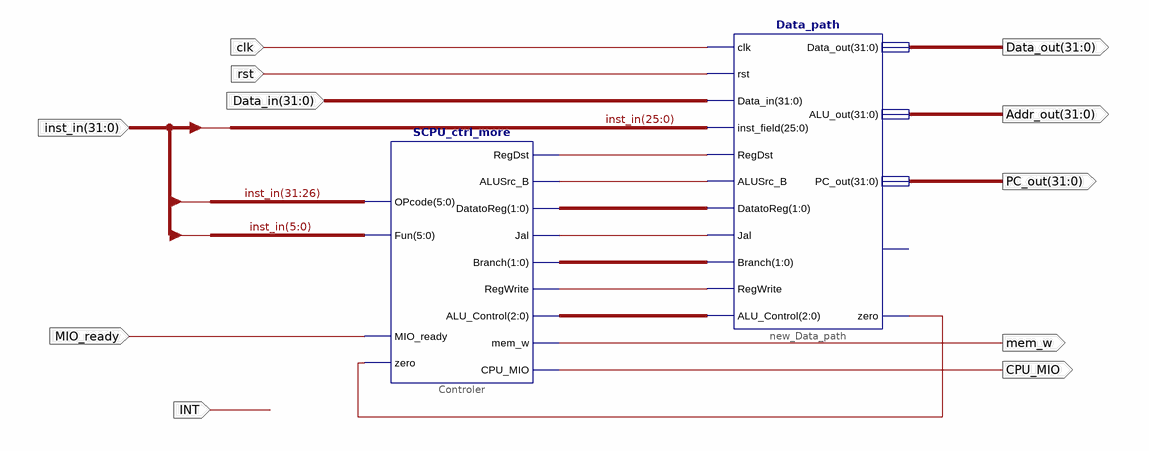
[diagram p0: schematic sheet 1]
// Xilinx ISE schematic SCPU.sch (kintex7) as structural Verilog: 2 symbols, 11 ports
module SCPU (
  input  clk,
  input  rst,
  input  [31:0] Data_in,
  input  [31:0] inst_in,
  input  MIO_ready,
  input  INT,
  output [31:0] Data_out,
  output [31:0] Addr_out,
  output [31:0] PC_out,
  output mem_w,
  output CPU_MIO
);

  wire XLXN_65, XLXN_66, XLXN_68, XLXN_70, XLXN_91;
  wire [1:0] XLXN_67, XLXN_69;
  wire [2:0] XLXN_71;

  SCPU_ctrl_more Controler (
    .RegDst(XLXN_65), .ALUSrc_B(XLXN_66), .DatatoReg(XLXN_67), .Jal(XLXN_68), .mem_w(mem_w),
    .Branch(XLXN_69), .RegWrite(XLXN_70), .ALU_Control(XLXN_71), .CPU_MIO(CPU_MIO), .OPcode(inst_in[31:26]),
    .Fun(inst_in[5:0]), .zero(XLXN_91), .MIO_ready(MIO_ready));
  Data_path new_Data_path (
    .Data_out(Data_out), .ALU_out(Addr_out), .PC_out(PC_out), .zero(XLXN_91), .clk(clk),
    .ALU_Control(XLXN_71), .RegWrite(XLXN_70), .Branch(XLXN_69), .Jal(XLXN_68), .DatatoReg(XLXN_67),
    .ALUSrc_B(XLXN_66), .RegDst(XLXN_65), .inst_field(inst_in[25:0]), .Data_in(Data_in), .rst(rst));  // open: overflow
endmodule
